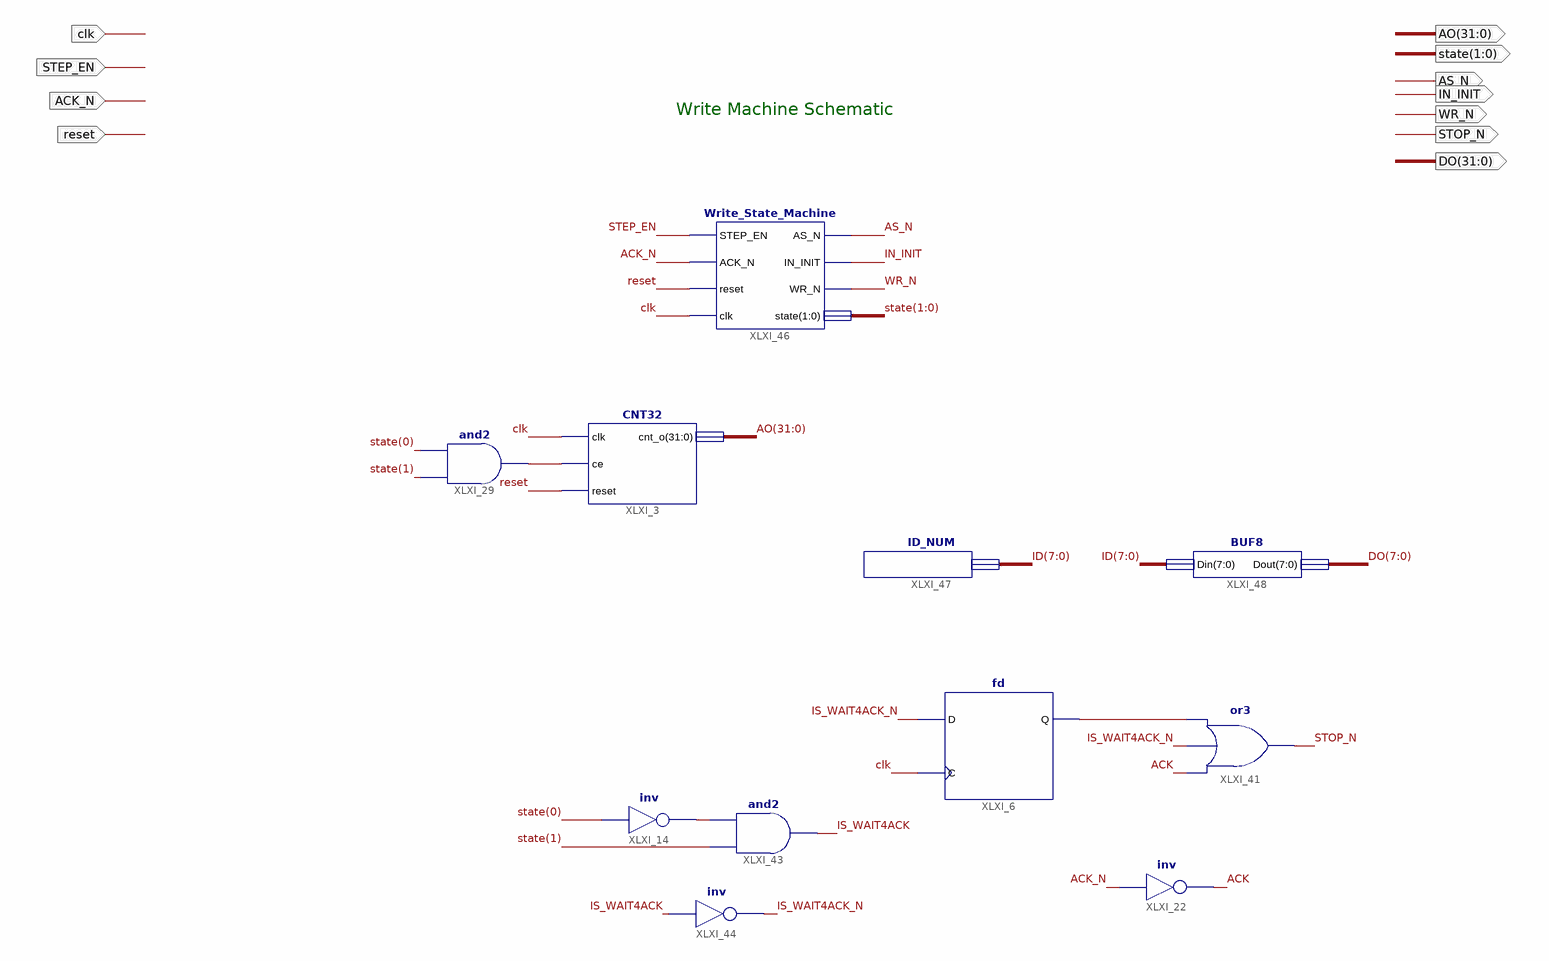
[diagram p0: schematic sheet 1]
// Xilinx ISE schematic Write_Machine.sch (spartan6) as structural Verilog: 11 symbols, 11 ports
module Write_Machine (
  input  STEP_EN,
  input  ACK_N,
  input  reset,
  input  clk,
  output AS_N,
  output IN_INIT,
  output WR_N,
  output [1:0] state,
  output [31:0] AO,
  output STOP_N,
  output [31:0] DO
);

  wire ACK, IS_WAIT4ACK, IS_WAIT4ACK_N, XLXN_10, XLXN_33, XLXN_100;
  wire [7:0] ID;

  CNT32 XLXI_3 (.clk(clk), .ce(XLXN_10), .reset(reset), .cnt_o(AO));
  and XLXI_29 (XLXN_10, state[1], state[0]);
  not XLXI_14 (XLXN_33, state[0]);
  fd XLXI_6 (.C(clk), .D(IS_WAIT4ACK_N), .Q(XLXN_100));
  not XLXI_22 (ACK, ACK_N);
  or XLXI_41 (STOP_N, ACK, IS_WAIT4ACK_N, XLXN_100);
  and XLXI_43 (IS_WAIT4ACK, state[1], XLXN_33);
  not XLXI_44 (IS_WAIT4ACK_N, IS_WAIT4ACK);
  Write_State_Machine XLXI_46 (
    .STEP_EN(STEP_EN), .ACK_N(ACK_N), .reset(reset), .clk(clk), .AS_N(AS_N), .IN_INIT(IN_INIT), .WR_N(WR_N),
    .state(state));
  ID_NUM XLXI_47 (.ID(ID));
  BUF8 XLXI_48 (.Din(ID), .Dout(DO[7:0]));

  // Notes on the sheet:
  //   Write Machine Schematic
endmodule
